# Altium schematic sheet X7A15T-Fabric.SchDoc: PCB-Tester X7A15T-Fabric
size A3; Address1: Hans-Bunte-Strasse 19; Address2: D-79108 Freiburg; Address3: Germany; DocumentNumber: U33110; SheetNumber: 9; SheetTotal: 20; Date: JUN 2020; CheckedBy: Moerz, Hoeren; Author: Rudziński; CompanyName: TDK-Micronas GmbH; DrawnBy: Rudziński; Engineer: Rudziński; DateDraw: JUN 2020; DateChecked: 2020-06-19; PageSetup: Record=PageOptions|CenterHorizontal=True|CenterVertical=True|PrintScale=0.97|XCorrection=1.00|YCorrection=1.00|PrintKind=0|BorderSize=5000000|LeftOffset=0|BottomOffset=0|Orientation=2|PaperLength=1000|PaperWidth=1000|Scale=100|PaperSource=7|PrintQuality=-3|MediaType=1|DitherType=10|PrintScaleMode=1|PaperKind=A4|PaperIndex=9; TitleTyp: Title-Typ; Block: CPU & SCT8; Workspace: Workspace
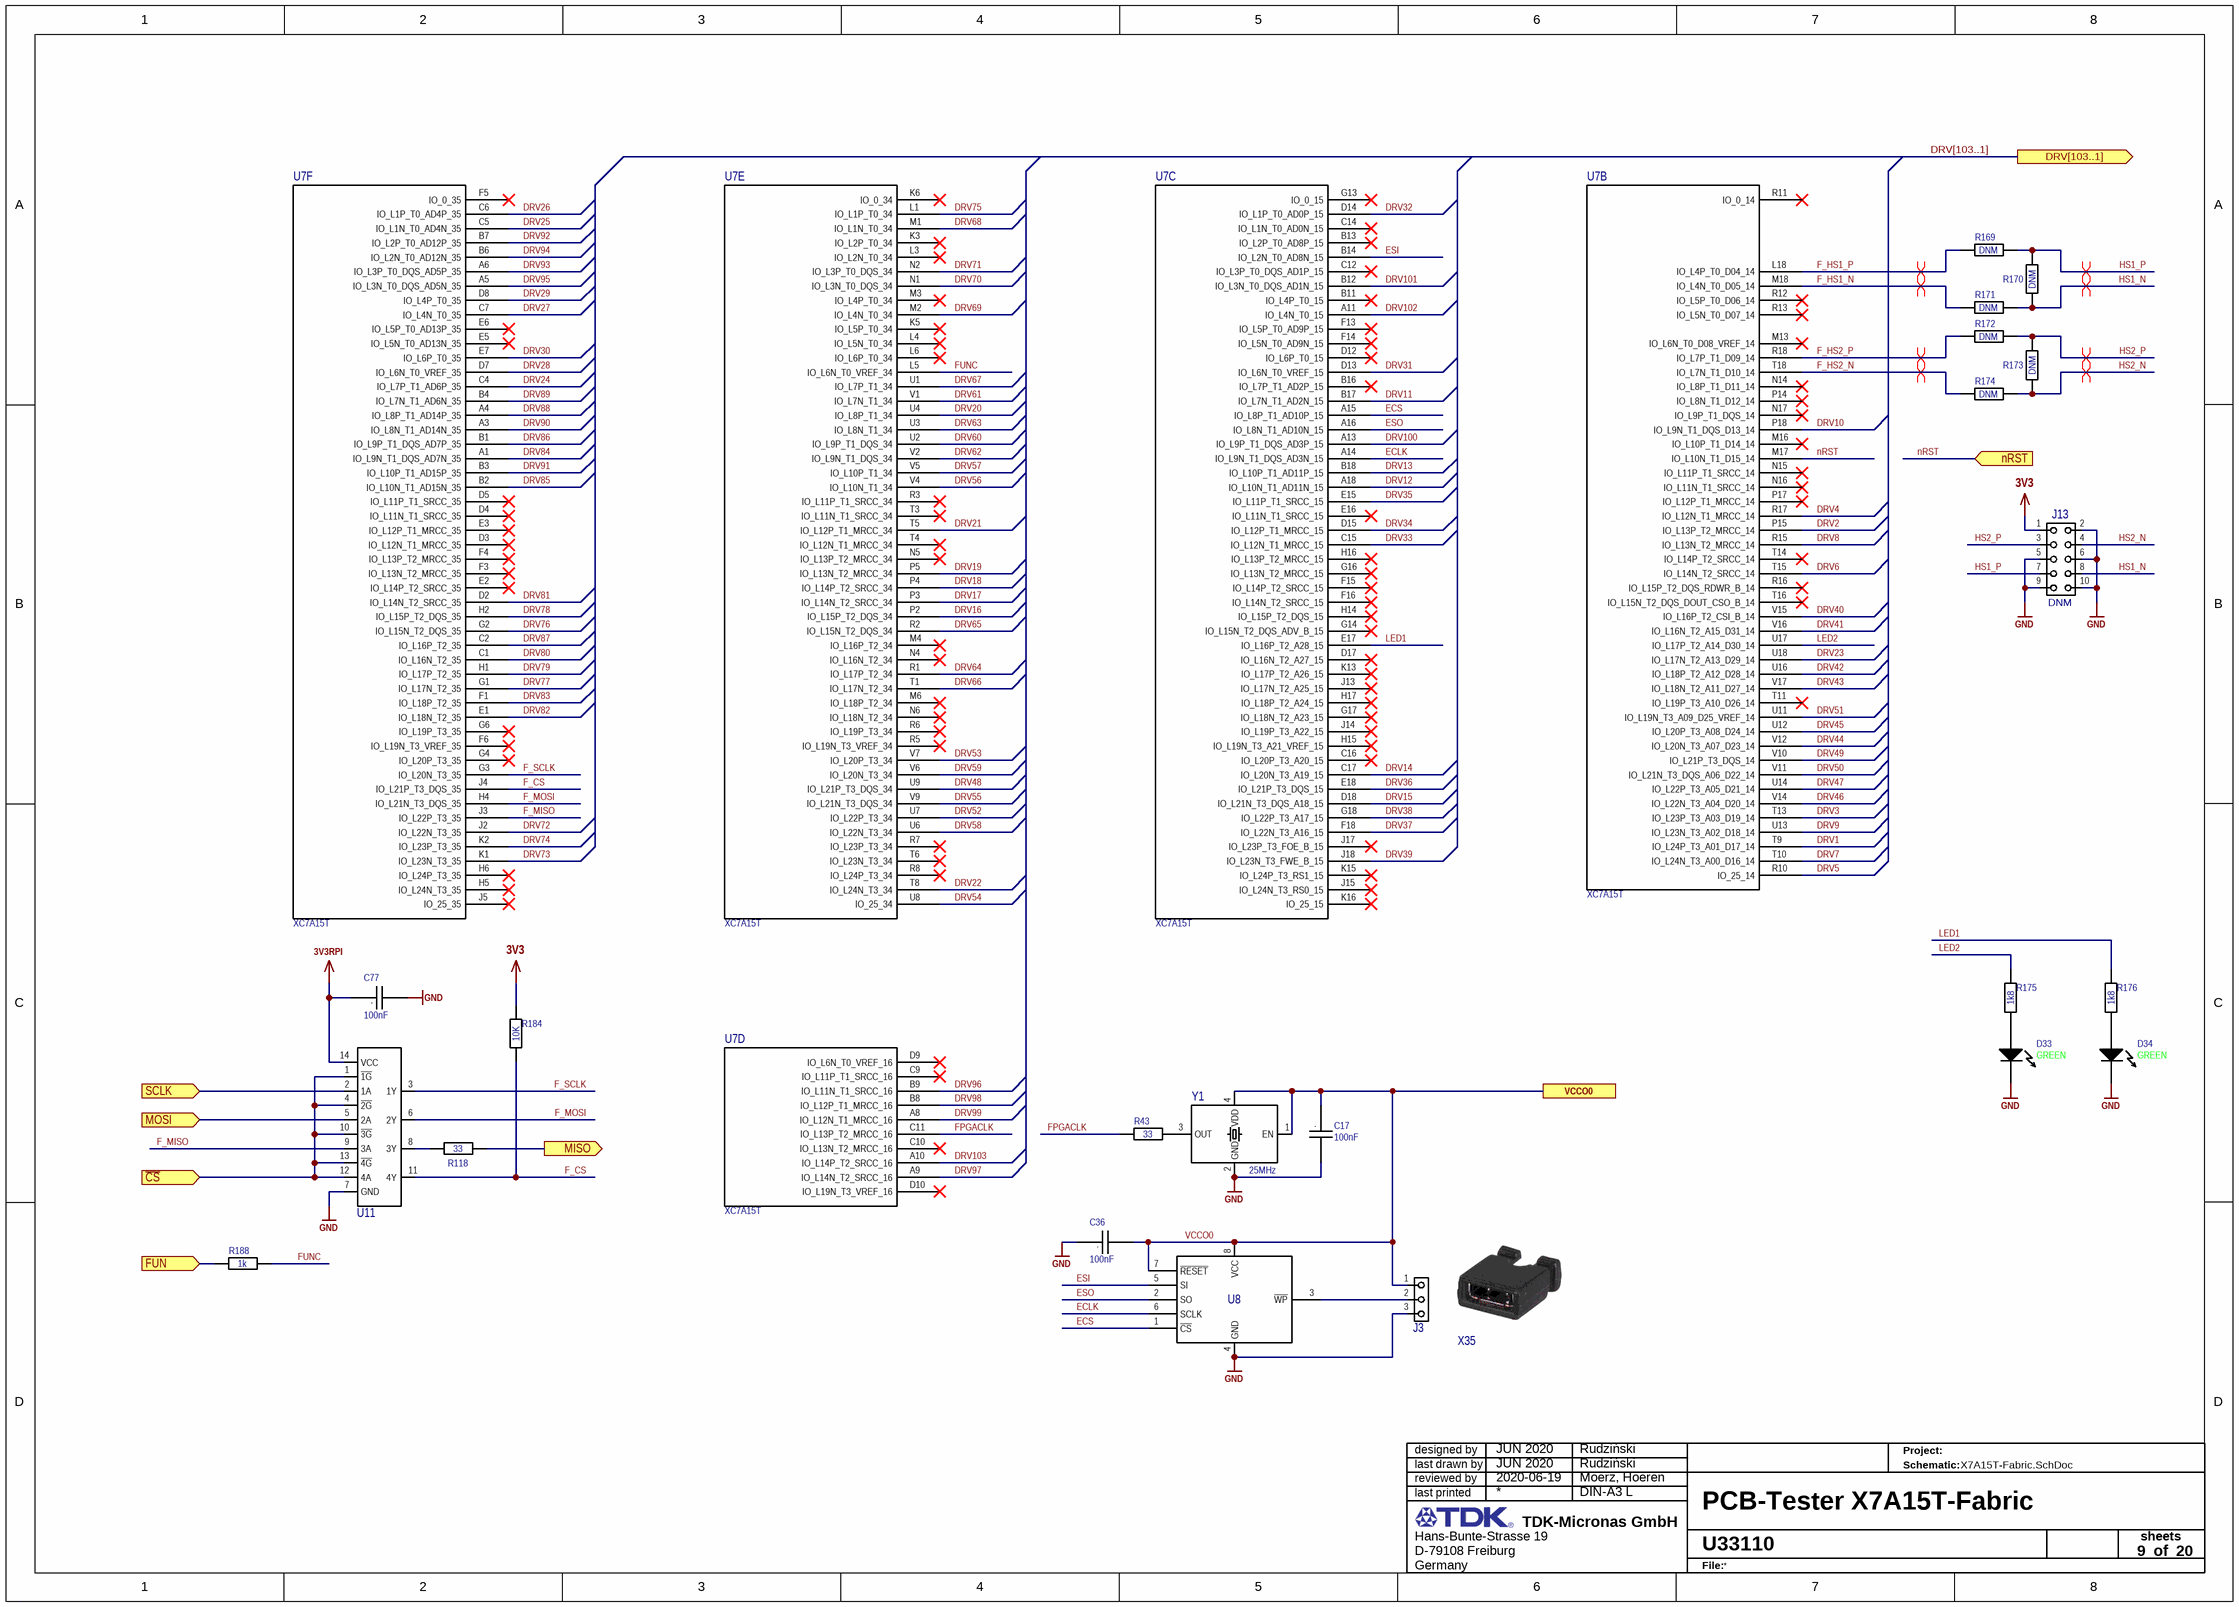
[diagram p0: X7A15T-Fabric.SchDoc]

## Parts
C17  value 100nF  [C0402 Reflow]  (hidden comment: C)
C36  value 100nF  [C0402 Reflow]  (hidden comment: C)
C77  value 100nF  [C0402 Reflow]  (hidden comment: C)
D33  Color: GREEN  [L0603G]  (hidden comment: D)
D34  Color: GREEN  [L0603G]  (hidden comment: D)
J3  J  [Header 100mil 3x1]  (value not drawn)
J13  NicName: DNM  [Header 100mil 5x2]  (hidden comment: J)  (no BOM)
R43  value 33  [R0402 Reflow]  (hidden comment: R)
R118  value 33  [R0402 Reflow]  (hidden comment: R)
R169  value DNM  [R0402 Reflow]  (hidden comment: R)  (no BOM)
R170  value DNM  [R0402 Reflow]  (hidden comment: R)  (no BOM)
R171  value DNM  [R0402 Reflow]  (hidden comment: R)  (no BOM)
R172  value DNM  [R0402 Reflow]  (hidden comment: R)  (no BOM)
R173  value DNM  [R0402 Reflow]  (hidden comment: R)  (no BOM)
R174  value DNM  [R0402 Reflow]  (hidden comment: R)  (no BOM)
R175  value 1k8  [R0603 Reflow]  (hidden comment: R)
R176  value 1k8  [R0603 Reflow]  (hidden comment: R)
R184  value 10K  [R0402 Reflow]  (hidden comment: R)
R188  value 1k  [R0402 Reflow]  (hidden comment: R)
U7  NicName: XC7A15T  [XC7A15T-1CSG324C]  (hidden comment: U)  (parts B,C,D,E,F of 8)
U8  U  [SOIC8 (R-8)]  (value not drawn)
U11  U  [TSSOP14]  (value not drawn)
X35  X  (value not drawn)
Y1  Frequency: 25MHz  [4SMD]  (hidden comment: Y)

## Ports
DRV[103..1] (out), FUN (in), MISO (out), MOSI (in), nRST (in), SCLK (in), VCCO0, ~{CS} (in)

## Nets
3V3: J13.1 R184.2
3V3RPI: C77.1 U11.14(VCC)
GND: C17.2 C36.1 C77.2 D33.2(Cathode) D34.2(Cathode) J3.3 J13.2 J13.5 J13.6 J13.9 J13.10 U8.4(GND) U11.7(GND) Y1.2(GND)
~{CS}: U11.1(~{1G}) U11.4(~{2G}) U11.10(~{3G}) U11.12(4A) U11.13(~{4G}) ; port ~{CS}
DRV1: U7.T9(IO_L24P_T3_A01_D17_14)
DRV2: U7.P15(IO_L13P_T2_MRCC_14)
DRV3: U7.T13(IO_L23P_T3_A03_D19_14)
DRV4: U7.R17(IO_L12N_T1_MRCC_14)
DRV5: U7.R10(IO_25_14)
DRV6: U7.T15(IO_L14N_T2_SRCC_14)
DRV7: U7.T10(IO_L24N_T3_A00_D16_14)
DRV8: U7.R15(IO_L13N_T2_MRCC_14)
DRV9: U7.U13(IO_L23N_T3_A02_D18_14)
DRV10: U7.P18(IO_L9N_T1_DQS_D13_14)
DRV11: U7.B17(IO_L7N_T1_AD2N_15)
DRV12: U7.A18(IO_L10N_T1_AD11N_15)
DRV13: U7.B18(IO_L10P_T1_AD11P_15)
DRV14: U7.C17(IO_L20N_T3_A19_15)
DRV15: U7.D18(IO_L21N_T3_DQS_A18_15)
DRV16: U7.P2(IO_L15P_T2_DQS_34)
DRV17: U7.P3(IO_L14N_T2_SRCC_34)
DRV18: U7.P4(IO_L14P_T2_SRCC_34)
DRV19: U7.P5(IO_L13N_T2_MRCC_34)
DRV20: U7.U4(IO_L8P_T1_34)
DRV21: U7.T5(IO_L12P_T1_MRCC_34)
DRV22: U7.T8(IO_L24N_T3_34)
DRV23: U7.U18(IO_L17N_T2_A13_D29_14)
DRV24: U7.C4(IO_L7P_T1_AD6P_35)
DRV25: U7.C5(IO_L1N_T0_AD4N_35)
DRV26: U7.C6(IO_L1P_T0_AD4P_35)
DRV27: U7.C7(IO_L4N_T0_35)
DRV28: U7.D7(IO_L6N_T0_VREF_35)
DRV29: U7.D8(IO_L4P_T0_35)
DRV30: U7.E7(IO_L6P_T0_35)
DRV31: U7.D13(IO_L6N_T0_VREF_15)
DRV32: U7.D14(IO_L1P_T0_AD0P_15)
DRV33: U7.C15(IO_L12N_T1_MRCC_15)
DRV34: U7.D15(IO_L12P_T1_MRCC_15)
DRV35: U7.E15(IO_L11P_T1_SRCC_15)
DRV36: U7.E18(IO_L21P_T3_DQS_15)
DRV37: U7.F18(IO_L22N_T3_A16_15)
DRV38: U7.G18(IO_L22P_T3_A17_15)
DRV39: U7.J18(IO_L23N_T3_FWE_B_15)
DRV40: U7.V15(IO_L16P_T2_CSI_B_14)
DRV41: U7.V16(IO_L16N_T2_A15_D31_14)
DRV42: U7.U16(IO_L18P_T2_A12_D28_14)
DRV43: U7.V17(IO_L18N_T2_A11_D27_14)
DRV44: U7.V12(IO_L20N_T3_A07_D23_14)
DRV45: U7.U12(IO_L20P_T3_A08_D24_14)
DRV46: U7.V14(IO_L22N_T3_A04_D20_14)
DRV47: U7.U14(IO_L22P_T3_A05_D21_14)
DRV48: U7.U9(IO_L21P_T3_DQS_34)
DRV49: U7.V10(IO_L21P_T3_DQS_14)
DRV50: U7.V11(IO_L21N_T3_DQS_A06_D22_14)
DRV51: U7.U11(IO_L19N_T3_A09_D25_VREF_14)
DRV52: U7.U7(IO_L22P_T3_34)
DRV53: U7.V7(IO_L20P_T3_34)
DRV54: U7.U8(IO_25_34)
DRV55: U7.V9(IO_L21N_T3_DQS_34)
DRV56: U7.V4(IO_L10N_T1_34)
DRV57: U7.V5(IO_L10P_T1_34)
DRV58: U7.U6(IO_L22N_T3_34)
DRV59: U7.V6(IO_L20N_T3_34)
DRV60: U7.U2(IO_L9P_T1_DQS_34)
DRV61: U7.V1(IO_L7N_T1_34)
DRV62: U7.V2(IO_L9N_T1_DQS_34)
DRV63: U7.U3(IO_L8N_T1_34)
DRV64: U7.R1(IO_L17P_T2_34)
DRV65: U7.R2(IO_L15N_T2_DQS_34)
DRV66: U7.T1(IO_L17N_T2_34)
DRV67: U7.U1(IO_L7P_T1_34)
DRV68: U7.M1(IO_L1N_T0_34)
DRV69: U7.M2(IO_L4N_T0_34)
DRV70: U7.N1(IO_L3N_T0_DQS_34)
DRV71: U7.N2(IO_L3P_T0_DQS_34)
DRV72: U7.J2(IO_L22N_T3_35)
DRV73: U7.K1(IO_L23N_T3_35)
DRV74: U7.K2(IO_L23P_T3_35)
DRV75: U7.L1(IO_L1P_T0_34)
DRV76: U7.G2(IO_L15N_T2_DQS_35)
DRV77: U7.G1(IO_L17N_T2_35)
DRV78: U7.H2(IO_L15P_T2_DQS_35)
DRV79: U7.H1(IO_L17P_T2_35)
DRV80: U7.C1(IO_L16N_T2_35)
DRV81: U7.D2(IO_L14N_T2_SRCC_35)
DRV82: U7.E1(IO_L18N_T2_35)
DRV83: U7.F1(IO_L18P_T2_35)
DRV84: U7.A1(IO_L9N_T1_DQS_AD7N_35)
DRV85: U7.B2(IO_L10N_T1_AD15N_35)
DRV86: U7.B1(IO_L9P_T1_DQS_AD7P_35)
DRV87: U7.C2(IO_L16P_T2_35)
DRV88: U7.A4(IO_L8P_T1_AD14P_35)
DRV89: U7.B4(IO_L7N_T1_AD6N_35)
DRV90: U7.A3(IO_L8N_T1_AD14N_35)
DRV91: U7.B3(IO_L10P_T1_AD15P_35)
DRV92: U7.B7(IO_L2P_T0_AD12P_35)
DRV93: U7.A6(IO_L3P_T0_DQS_AD5P_35)
DRV94: U7.B6(IO_L2N_T0_AD12N_35)
DRV95: U7.A5(IO_L3N_T0_DQS_AD5N_35)
DRV96: U7.B9(IO_L11N_T1_SRCC_16)
DRV97: U7.A9(IO_L14N_T2_SRCC_16)
DRV98: U7.B8(IO_L12P_T1_MRCC_16)
DRV99: U7.A8(IO_L12N_T1_MRCC_16)
DRV100: U7.A13(IO_L9P_T1_DQS_AD3P_15)
DRV101: U7.B12(IO_L3N_T0_DQS_AD1N_15)
DRV102: U7.A11(IO_L4N_T0_15)
DRV103: U7.A10(IO_L14P_T2_SRCC_16)
ECLK: U7.A14(IO_L9N_T1_DQS_AD3N_15) U8.6(SCLK)
ECS: U7.A15(IO_L8P_T1_AD10P_15) U8.1(~{CS})
ESI: U7.B14(IO_L2N_T0_AD8N_15) U8.5(SI)
ESO: U7.A16(IO_L8N_T1_AD10N_15) U8.2(SO)
F_CS: R184.1 U7.J4(IO_L21P_T3_DQS_35) U11.11(4Y)
F_HS1_N: R171.1 U7.M18(IO_L4N_T0_D05_14)
F_HS1_P: R169.1 U7.L18(IO_L4P_T0_D04_14)
F_HS2_N: R174.1 U7.T18(IO_L7N_T1_D10_14)
F_HS2_P: R172.1 U7.R18(IO_L7P_T1_D09_14)
F_MISO: U7.J3(IO_L22P_T3_35) U11.9(3A)
F_MOSI: U7.H4(IO_L21N_T3_DQS_35) U11.6(2Y)
F_SCLK: U7.G3(IO_L20N_T3_35) U11.3(1Y)
FPGACLK: R43.2 U7.C11(IO_L13P_T2_MRCC_16)
FUN: R188.2 ; port FUN
FUNC: R188.1 U7.L5(IO_L6N_T0_VREF_34)
HS1_N: J13.8 R170.1 R171.2
HS1_P: J13.7 R169.2 R170.2
HS2_N: J13.4 R173.1 R174.2
HS2_P: J13.3 R172.2 R173.2
LED1: R176.2 U7.E17(IO_L16P_T2_A28_15)
LED2: R175.2 U7.U17(IO_L17P_T2_A14_D30_14)
MISO: R118.1 ; port MISO
MOSI: U11.5(2A) ; port MOSI
nRST: U7.M17(IO_L10N_T1_D15_14) ; port nRST
SCLK: U11.2(1A) ; port SCLK
VCCO0: C17.1 C36.2 J3.1 U8.7(~{RESET}) U8.8(VCC) Y1.1(EN) Y1.4(VDD) ; port VCCO0
NetD33_1: D33.1(Anode) R175.1
NetD34_1: D34.1(Anode) R176.1
NetJ3_2: J3.2 U8.3(~{WP})
NetR43_1: R43.1 Y1.3(OUT)
NetR118_2: R118.2 U11.8(3Y)

Not connected (* = marked no-connect by the designer): U7 B11(IO_L4P_T0_15)* B13(IO_L2P_T0_AD8P_15)* B16(IO_L7P_T1_AD2P_15)* C9(IO_L11P_T1_SRCC_16)* C10(IO_L13N_T2_MRCC_16)* C12(IO_L3P_T0_DQS_AD1P_15)* C14(IO_L1N_T0_AD0N_15)* C16(IO_L20P_T3_A20_15)* D3(IO_L12N_T1_MRCC_35)* D4(IO_L11N_T1_SRCC_35)* D5(IO_L11P_T1_SRCC_35)* D9(IO_L6N_T0_VREF_16)* D10(IO_L19N_T3_VREF_16)* D12(IO_L6P_T0_15)* D17(IO_L16N_T2_A27_15)* E2(IO_L14P_T2_SRCC_35)* E3(IO_L12P_T1_MRCC_35)* E5(IO_L5N_T0_AD13N_35)* E6(IO_L5P_T0_AD13P_35)* E16(IO_L11N_T1_SRCC_15)* F3(IO_L13N_T2_MRCC_35)* F4(IO_L13P_T2_MRCC_35)* F5(IO_0_35)* F6(IO_L19N_T3_VREF_35)* F13(IO_L5P_T0_AD9P_15)* F14(IO_L5N_T0_AD9N_15)* F15(IO_L14P_T2_SRCC_15)* F16(IO_L14N_T2_SRCC_15)* G4(IO_L20P_T3_35)* G6(IO_L19P_T3_35)* G13(IO_0_15)* G14(IO_L15N_T2_DQS_ADV_B_15)* G16(IO_L13N_T2_MRCC_15)* G17(IO_L18N_T2_A23_15)* H5(IO_L24N_T3_35)* H6(IO_L24P_T3_35)* H14(IO_L15P_T2_DQS_15)* H15(IO_L19N_T3_A21_VREF_15)* H16(IO_L13P_T2_MRCC_15)* H17(IO_L18P_T2_A24_15)* J5(IO_25_35)* J13(IO_L17N_T2_A25_15)* J14(IO_L19P_T3_A22_15)* J15(IO_L24N_T3_RS0_15)* J17(IO_L23P_T3_FOE_B_15)* K3(IO_L2P_T0_34)* K5(IO_L5P_T0_34)* K6(IO_0_34)* K13(IO_L17P_T2_A26_15)* K15(IO_L24P_T3_RS1_15)* K16(IO_25_15)* L3(IO_L2N_T0_34)* L4(IO_L5N_T0_34)* L6(IO_L6P_T0_34)* M3(IO_L4P_T0_34)* M4(IO_L16P_T2_34)* M6(IO_L18P_T2_34)* M13(IO_L6N_T0_D08_VREF_14)* M16(IO_L10P_T1_D14_14)* N4(IO_L16N_T2_34)* N5(IO_L13P_T2_MRCC_34)* N6(IO_L18N_T2_34)* N14(IO_L8P_T1_D11_14)* N15(IO_L11P_T1_SRCC_14)* N16(IO_L11N_T1_SRCC_14)* N17(IO_L9P_T1_DQS_14)* P14(IO_L8N_T1_D12_14)* P17(IO_L12P_T1_MRCC_14)* R3(IO_L11P_T1_SRCC_34)* R5(IO_L19N_T3_VREF_34)* R6(IO_L19P_T3_34)* R7(IO_L23P_T3_34)* R8(IO_L24P_T3_34)* R11(IO_0_14)* R12(IO_L5P_T0_D06_14)* R13(IO_L5N_T0_D07_14)* R16(IO_L15P_T2_DQS_RDWR_B_14)* T3(IO_L11N_T1_SRCC_34)* T4(IO_L12N_T1_MRCC_34)* T6(IO_L23N_T3_34)* T11(IO_L19P_T3_A10_D26_14)* T14(IO_L14P_T2_SRCC_14)* T16(IO_L15N_T2_DQS_DOUT_CSO_B_14)*

## Buses and harness runs
bus DRV[103..1] = port DRV[103..1]

## Layout directives
differential pair; net class GENHS_DP: F_HS1_N, F_HS1_P, F_HS2_N, F_HS2_P, HS1_N, HS1_P, HS2_N, HS2_P

## Notes on the sheet
- designed by
- reviewed by
- last drawn by
- Project:
- Schematic:
- last printed
- DIN-A3 L
- sheets
- of
- File:
- (in symbol C) .

## Library data of the parts
C17 C36 C77 = C: CAP CER 0.1UF 25V X7R 0402; 04. Manufacturer: Yageo; 07. Manufacturer  Part Number: CC0402KRX7R8BB104; Tolerance: ±5%; Voltage Rating: 16V; 03. Unit Price: 0.09; 13. Created Date/Name: AUG2018/Hören; Type: X7R; ComponentLink1Description: Info; ComponentLink1URL: https://www.digikey.de/product-detail/en/kemet/C0402C104J4RACTU/399-7761-6-ND/3472292; 02. Distributor Part Number: 311-2077-6-ND; 09. Operating Temperature: -55°C ~ 125°C; 11. RoHS: YES; 01. Distributor: DigiKey; ComponentLink2Description: DataSheet; ComponentLink2URL: https://content.kemet.com/datasheets/KEM_C1002_X7R_SMD.pdf; Package: 0402
D33 D34 = LED: LED GREEN DIFFUSED 0603 SMD; 04. Manufacturer: OSRAM Opto Semiconductors Inc.; 07. Manufacturer  Part Number: LG L29K-G2J1-24-Z; Vf: 1.7V; If: 2mA; Wave Length: 570nm; Viewing Angle: 160°; 03. Unit Price: 0.4; 13. Created Date/Name: AUG2018/Hören; ComponentLink1Description: Info; ComponentLink1URL: https://www.digikey.de/products/en?keywords=475-2709-6-ND; ComponentLink2Description: DataSheet; ComponentLink2URL: https://www.digikey.de/products/en?keywords=475-2709-6-ND; 02. Distributor Part Number: 475-2709-6-ND; 11. RoHS: YES; 01. Distributor: DigiKey
J3 = Header 3Pins 100mil: CONN HEADER VERT 3POS 2.54MM; 04. Manufacturer: Samtec Inc.; 07. Manufacturer  Part Number: HMTSW-103-07-G-S-240; 03. Unit Price: 0.25; 13. Created Date/Name: AUG2018/Hören; 01. Distributor: Samtec Inc.; 02. Distributor Part Number: HMTSW-103-07-G-S-240; 11. RoHS: YES; ComponentLink1Description: Info; ComponentLink1URL: https://www.samtec.com/products/hmtsw-103-07-g-s-240; ComponentLink2Description: DataSheet; ComponentLink2URL: http://suddendocs.samtec.com/catalog_english/hmtsw.pdf
J13 = Header 5x2Pins 100mil: 04. Manufacturer: Samtec Inc.; 07. Manufacturer  Part Number: HMTSW-103-07-G-S-240; 03. Unit Price: 0.25; 13. Created Date/Name: AUG2018/Hören; 01. Distributor: Samtec Inc.; 02. Distributor Part Number: HMTSW-103-07-G-S-240; 11. RoHS: YES; ComponentLink1Description: Info; ComponentLink1URL: https://www.samtec.com/products/hmtsw-103-07-g-s-240; ComponentLink2Description: DataSheet; ComponentLink2URL: http://suddendocs.samtec.com/catalog_english/hmtsw.pdf
R43 R118 = R: RES SMD 33 OHM 1% 1/16W 0402; 04. Manufacturer: Yageo; 07. Manufacturer  Part Number: RC0402FR-0733RL; 03. Unit Price: 0.09; 13. Created Date/Name: AUG2018/Hören; Power Rating: 63mW; Tolerance: ±1%; ComponentLink1URL: https://www.digikey.de/products/en?keywords=311-33.0LRDKR-ND; ComponentLink1Description: Info; 02. Distributor Part Number: 311-33.0LRDKR-ND; 09. Operating Temperature: -55°C ~ 155°C; 11. RoHS: YES; 01. Distributor: DigiKey; ComponentLink2Description: DataSheet; Type: Thick Film; Package: 0402
R169-R174 = R_19: RES SMD 33 OHM 1% 1/16W 0402; 04. Manufacturer: Yageo; 07. Manufacturer  Part Number: RC0402FR-0733RL; 03. Unit Price: 0.09; 13. Created Date/Name: AUG2018/Hören; Power Rating: 63mW; Tolerance: ±1%; ComponentLink1URL: https://www.digikey.de/products/en?keywords=311-33.0LRDKR-ND; ComponentLink1Description: Info; 02. Distributor Part Number: 311-33.0LRDKR-ND; 09. Operating Temperature: -55°C ~ 155°C; 11. RoHS: YES; 01. Distributor: DigiKey; ComponentLink2Description: DataSheet; Type: Thick Film; Package: 0402
R175 R176 = R: RES SMD 1.8K OHM 1% 1/16W 0402; 04. Manufacturer: Yageo; 07. Manufacturer  Part Number: RC0402FR-071K8L; 03. Unit Price: 0.09; 13. Created Date/Name: AUG2018/Hören; Power Rating: 63mW; Tolerance: ±1%; ComponentLink1URL: https://www.digikey.de/product-detail/en/yageo/RC0402FR-071K65L/YAG3043DKR-ND/5282914; ComponentLink1Description: Info; 02. Distributor Part Number: 311-1.80KLRCT-ND; 09. Operating Temperature: -55°C ~ 155°C; 11. RoHS: YES; 01. Distributor: DigiKey; ComponentLink2Description: DataSheet; Type: Thick Film; Package: 0402
R184 = R_10: RES SMD 10K OHM 1% 1/16W 0402; 04. Manufacturer: Yageo; 07. Manufacturer  Part Number: RC0402FR-0710KL; 03. Unit Price: 0.09; 13. Created Date/Name: AUG2018/Hören; Power Rating: 63mW; Tolerance: ±1%; ComponentLink1URL: https://www.digikey.de/products/en?keywords=311-10.0KLRDKR-ND; ComponentLink1Description: Info; 02. Distributor Part Number: 311-10.0KLRDKR-ND; 09. Operating Temperature: -55°C ~ 155°C; 11. RoHS: YES; 01. Distributor: DigiKey; ComponentLink2Description: DataSheet; Type: Thick Film; Package: 0402
R188 = R: RES SMD 1K OHM 1% 1/16W 0402; 04. Manufacturer: Yageo; 07. Manufacturer  Part Number: RC0402FR-071KP; 03. Unit Price: 0.09; 13. Created Date/Name: AUG2018/Hören; Power Rating: 63mW; Tolerance: ±1%; ComponentLink1URL: https://www.digikey.de/products/en?keywords=311-10.0KLRDKR-ND; ComponentLink1Description: Info; 02. Distributor Part Number: YAG1254CT-ND; 09. Operating Temperature: -55°C ~ 155°C; 11. RoHS: YES; 01. Distributor: DigiKey; ComponentLink2Description: DataSheet; Type: Thick Film; Package: 0402
U7 = XC7A15T-CS324: XC7A15T-1CSG324C; MFR: XILINX; POPULATED: yes; 03. Unit Price: 20.65; MFR-PN: XC7A15T-CS324; 04. Manufacturer: XILINX; 07. Manufacturer  Part Number: XC7A15T-1CSG324C; 01. Distributor: Avnet; 02. Distributor Part Number: XC7A15T-1CSG324C; 09. Operating Temperature: 0°C ~ 85°C (TJ); 11. RoHS: YES; ComponentLink4Description: Info; ComponentLink4URL: https://www.digikey.de/products/en?keywords=XC7A15T-1CSG324C; ComponentLink5Description: DataSheet; ComponentLink5URL: https://www.xilinx.com/support/documentation/data_sheets/ds181_Artix_7_Data_Sheet.pdf; ComponentLink6Description: NXP; ComponentLink6URL: https://www.nxp.com/part/MK20DN512VMD10
U8 = MX25R3235FM1IH0: IC FLASH 32M SPI 80MHZ 8SOP; 04. Manufacturer: Macronix; 03. Unit Price: 0.79; 13. Created Date/Name: AUG 2018 / Hören; 01. Distributor: DigiKey; 02. Distributor Part Number: 1092-1175-ND; 07. Manufacturer  Part Number: MX25R3235FM1IH0; ComponentLink1Description: Info; ComponentLink1URL: https://www.digikey.de/product-detail/en/macronix/MX25R3235FM1IH0/1092-1175-ND/5957736; ComponentLink2Description: DataSheet; ComponentLink2URL: https://www.macronix.com/Lists/Datasheet/Attachments/7534/MX25R3235F%2c%20Wide%20Range%2c%2032Mb%2c%20v1.6.pdf
U11 = 74LCX125: IC BUF NON-INVERT 3.6V 14TSSOP; 04. Manufacturer: STMicroelectronics; 07. Manufacturer  Part Number: 74LCX125YTTR; 03. Unit Price: 0.51; 01. Distributor: DigiKey; 02. Distributor Part Number: 497-13204-1-ND; 11. RoHS: YES; ComponentLink1Description: Info; ComponentLink2Description: DataSheet; Package: TSSOP14
X35 = Jumper: CONN JUMPER SHORTING .100" GOLD; 04. Manufacturer: Sullins Connector Solutions; 07. Manufacturer  Part Number: QPC02SXGN-RC; 03. Unit Price: 0.09; 13. Created Date/Name: AUG2018/Hören; 01. Distributor: DigiKey; 02. Distributor Part Number: S9337-ND; 09. Operating Temperature: -xx..+yy°C; 11. RoHS: ???; ComponentLink1Description: Info; ComponentLink1URL: https://www.digikey.de/product-detail/en/sullins-connector-solutions/QPC02SXGN-RC/S9337-ND/2618262; ComponentLink2Description: DataSheet
Y1 = ASE-25.000MHZ-LC-T: XTAL OSC XO 25.0000MHZ CMOS SMD; 04. Manufacturer: Abracon LLC; 03. Unit Price: 1.46; 13. Created Date/Name: AUG 2018 / Hören; 01. Distributor: DigiKey; 02. Distributor Part Number: 535-9568-1-ND; 07. Manufacturer  Part Number: ASE-25.000MHZ-LC-T; 11. RoHS: YES; ComponentLink1Description: Info; ComponentLink1URL: https://www.digikey.de/products/en?keywords=535-9568-1-ND; ComponentLink2Description: DataSheet; Package: 4SMD